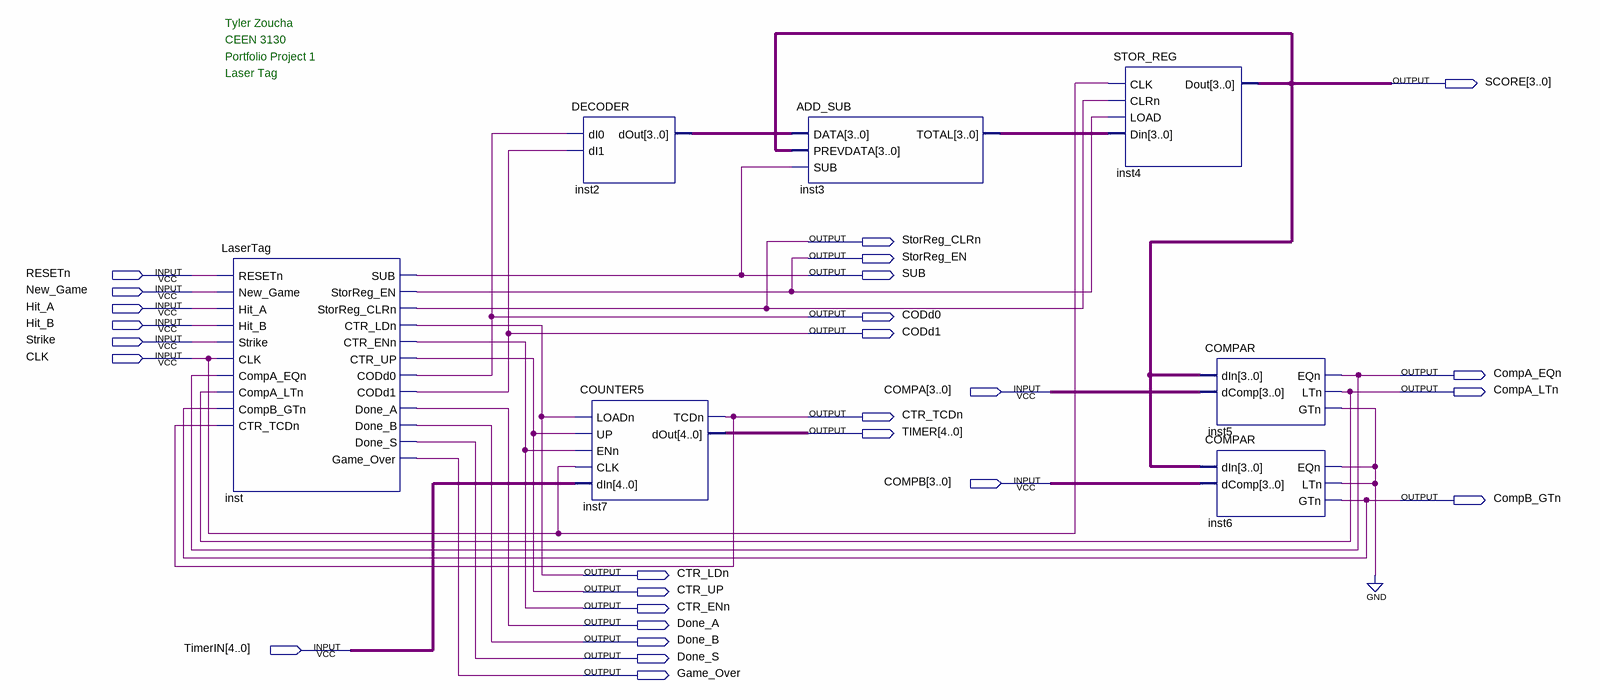
[diagram p0: schematic sheet]
// Quartus schematic Block1.bdf as structural Verilog: 7 symbols, 27 pins
module Block1 (
  input  RESETn,
  input  New_Game,
  input  Hit_A,
  input  Hit_B,
  input  Strike,
  input  CLK,
  input  [3:0] COMPA,
  input  [3:0] COMPB,
  input  [4:0] TimerIN,
  output [3:0] SCORE,
  output StorReg_CLRn,
  output StorReg_EN,
  output SUB,
  output CODd0,
  output CODd1,
  output CompA_EQn,
  output CompA_LTn,
  output CTR_TCDn,
  output [4:0] TIMER,
  output CompB_GTn,
  output CTR_LDn,
  output CTR_UP,
  output CTR_ENn,
  output Done_A,
  output Done_B,
  output Done_S,
  output Game_Over
);

  wire inst5_gtn;
  wire [3:0] inst2_dout, inst3_total;

  LaserTag inst (
    .RESETn(RESETn), .New_Game(New_Game), .Hit_A(Hit_A), .Hit_B(Hit_B), .Strike(Strike), .CLK(CLK),
    .CompA_EQn(CompA_EQn), .CompA_LTn(CompA_LTn), .CompB_GTn(CompB_GTn), .CTR_TCDn(CTR_TCDn), .SUB(SUB),
    .StorReg_EN(StorReg_EN), .StorReg_CLRn(StorReg_CLRn), .CTR_LDn(CTR_LDn), .CTR_ENn(CTR_ENn),
    .CTR_UP(CTR_UP), .CODd0(CODd0), .CODd1(CODd1), .Done_A(Done_A), .Done_B(Done_B), .Done_S(Done_S),
    .Game_Over(Game_Over));
  DECODER inst2 (.dI0(CODd0), .dI1(CODd1), .dOut(inst2_dout));
  COUNTER5 inst7 (.LOADn(CTR_LDn), .UP(CTR_UP), .ENn(CTR_ENn), .CLK(CLK), .dIn(TimerIN), .TCDn(CTR_TCDn), .dOut(TIMER));
  ADD_SUB inst3 (.DATA(inst2_dout), .PREVDATA(SCORE), .SUB(SUB), .TOTAL(inst3_total));
  STOR_REG inst4 (.CLK(CLK), .CLRn(StorReg_CLRn), .LOAD(StorReg_EN), .Din(inst3_total), .Dout(SCORE));
  COMPAR inst5 (.dIn(SCORE), .dComp(COMPA), .EQn(CompA_EQn), .LTn(CompA_LTn), .GTn(inst5_gtn));
  COMPAR inst6 (.dIn(SCORE), .dComp(COMPB), .EQn(inst5_gtn), .LTn(inst5_gtn), .GTn(CompB_GTn));
  // also tied to GND on the sheet: inst5_gtn

  // Notes on the sheet:
  //   Tyler Zoucha
  //   CEEN 3130
  //   Portfolio Project 1
  //   Laser Tag
endmodule
